# EAGLE design Main (EAGLE 8.6.3)
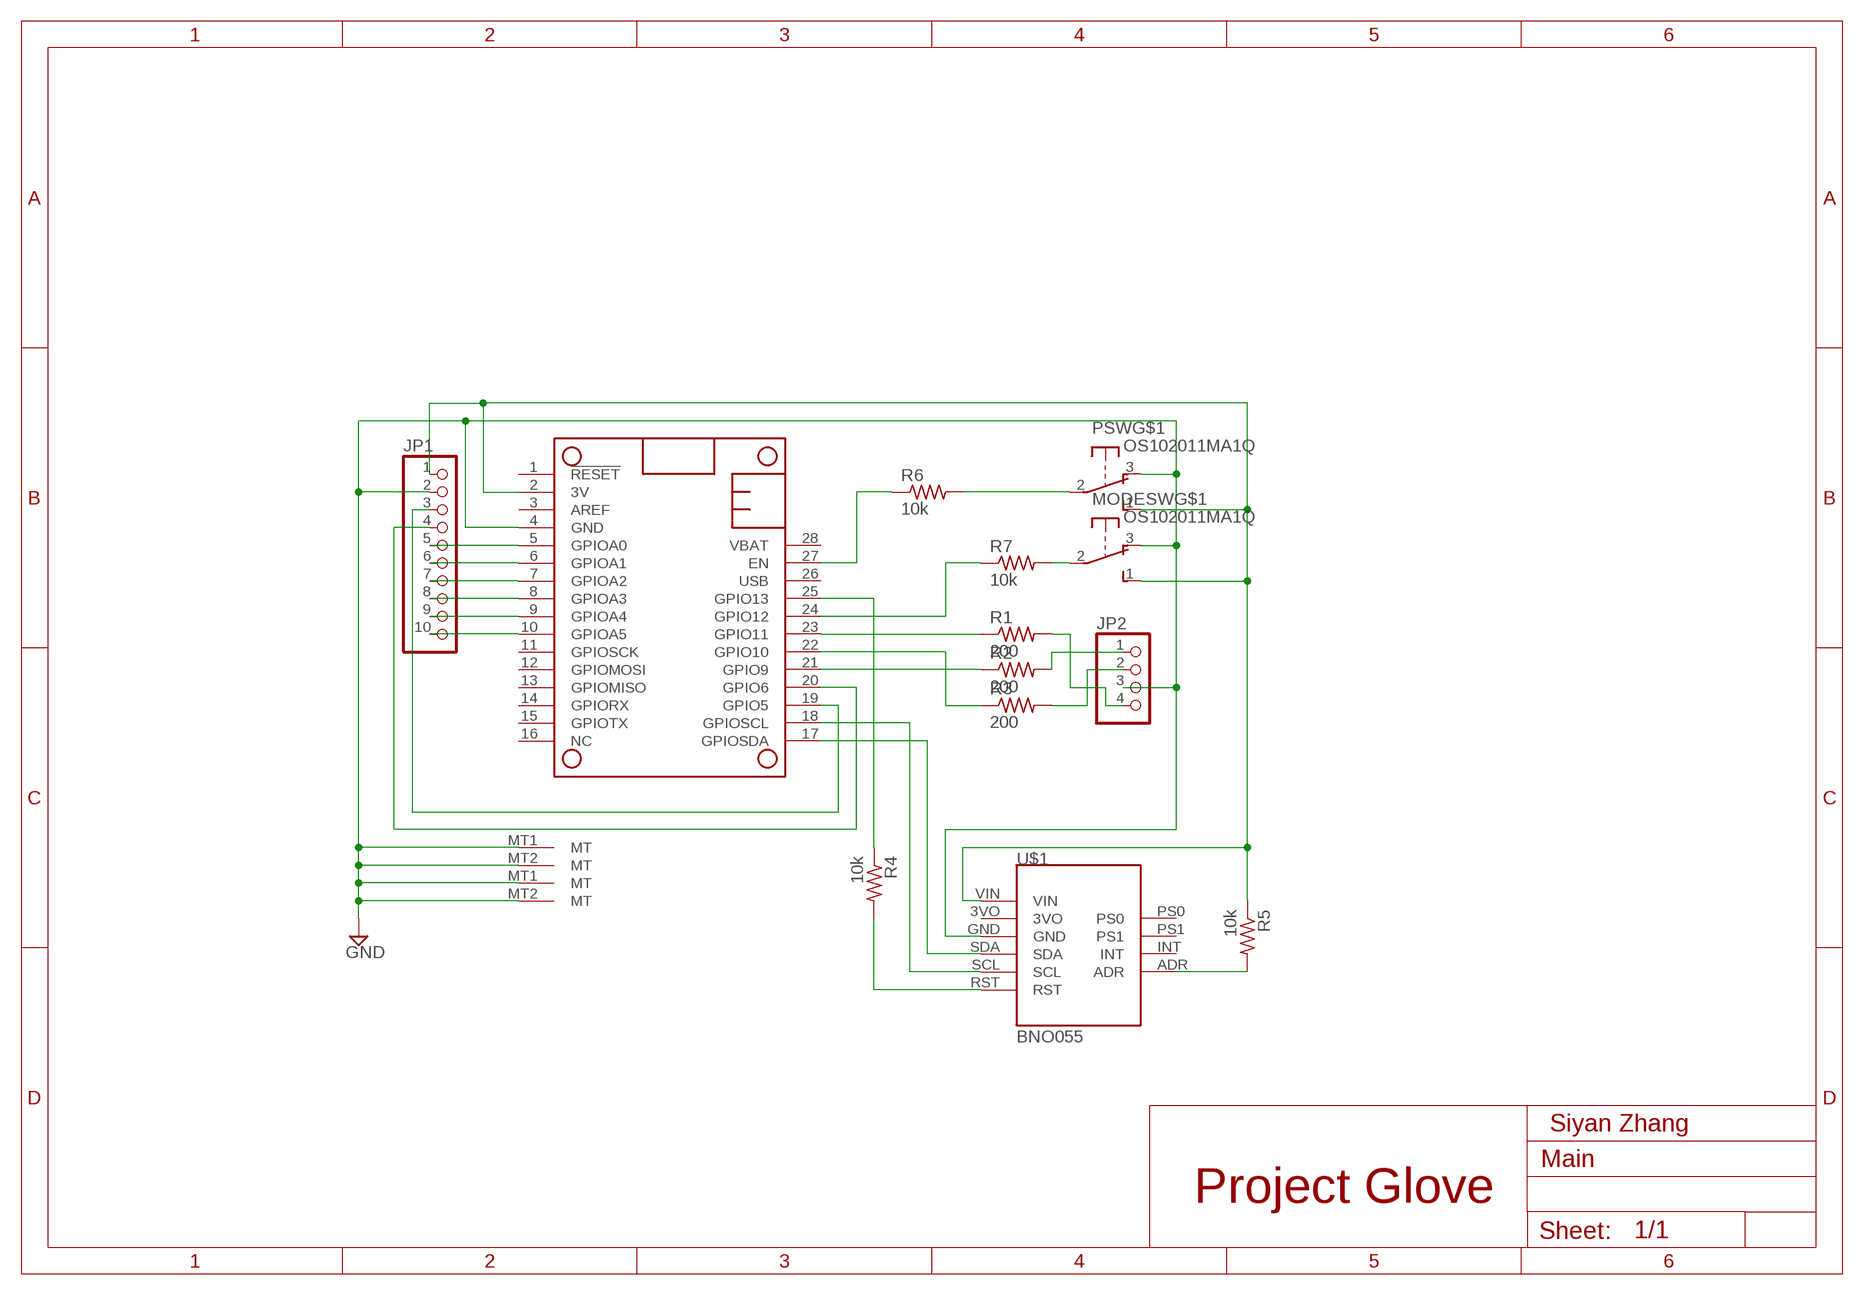
[diagram p0: schematic, sheet 1]

## Parts
JP1  PINHD-1X10  [1X10]
JP2  PINHD-1X4  [1X04]
MODESW  OS102011MA1Q  [OS102011MA1Q]
MS1  FEATHERWING  [FEATHERWING]
PSW  OS102011MA1Q  [OS102011MA1Q]
R1  200  R-US_0207/7  [0207/7]
R2  200  R-US_0207/7  [0207/7]
R3  200  R-US_0207/7  [0207/7]
R4  10k  R-US_0207/7  [0207/7]
R5  10k  R-US_0207/15  [0207/15]
R6  10k  R-US_0207/7  [0207/7]
R7  10k  R-US_0207/7  [0207/7]
U$1  BNO055  [BNO055]

## Nets
3V: JP1.1 MODESW.1(S) MS1.2(3V) PSW.1(S) R5.1 U$1.VIN
GND: JP1.2 JP2.3 MODESW.3(O) MODESW.MT1(MT) MODESW.MT2(MT) MS1.4(GND) PSW.3(O) PSW.MT1(MT) PSW.MT2(MT) U$1.GND
N$1: MODESW.2(P) R7.2
N$2: MS1.24(GPIO12) R7.1
N$3: MS1.22(GPIO10) R3.1
N$4: MS1.21(GPIO9) R2.1
N$5: MS1.23(GPIO11) R1.1
N$6: JP2.4 R1.2
N$7: JP2.1 R2.2
N$8: JP2.2 R3.2
N$9: JP1.10 MS1.10(GPIOA5)
N$10: JP1.9 MS1.9(GPIOA4)
N$11: JP1.8 MS1.8(GPIOA3)
N$12: JP1.7 MS1.7(GPIOA2)
N$13: JP1.6 MS1.6(GPIOA1)
N$14: MS1.17(GPIOSDA) U$1.SDA
N$15: MS1.18(GPIOSCL) U$1.SCL
N$16: R4.2 U$1.RST
N$17: R5.2 U$1.ADR
N$18: MS1.25(GPIO13) R4.1
N$19: JP1.5 MS1.5(GPIOA0)
N$20: PSW.2(P) R6.2
N$21: MS1.27(EN) R6.1
N$22: JP1.3 MS1.19(GPIO5)
N$23: JP1.4 MS1.20(GPIO6)
Unconnected: MS1.1(!RESET) MS1.3(AREF) MS1.11(GPIOSCK) MS1.12(GPIOMOSI) MS1.13(GPIOMISO) MS1.14(GPIORX) MS1.15(GPIOTX) MS1.16(NC) MS1.26(USB) MS1.28(VBAT) U$1.3VO U$1.INT U$1.PS0 U$1.PS1

## Notes on the sheet
- Siyan Zhang
- Project Glove
- Sheet:

## Library data of the parts
JP1 = pinhead:PINHD-1X10: PIN HEADER
JP2 = pinhead:PINHD-1X4: PIN HEADER
MODESW PSW = adafruit:OS102011MA1Q: OS10201MA1Q through-hole right angle switch http://www.ladyada.net/library/eagle
MS1 = adafruit:FEATHERWING
R1-R7 = resistor:R-US_: RESISTOR, American symbol
U$1 = Adafruit_BNO055:BNO055

## Board
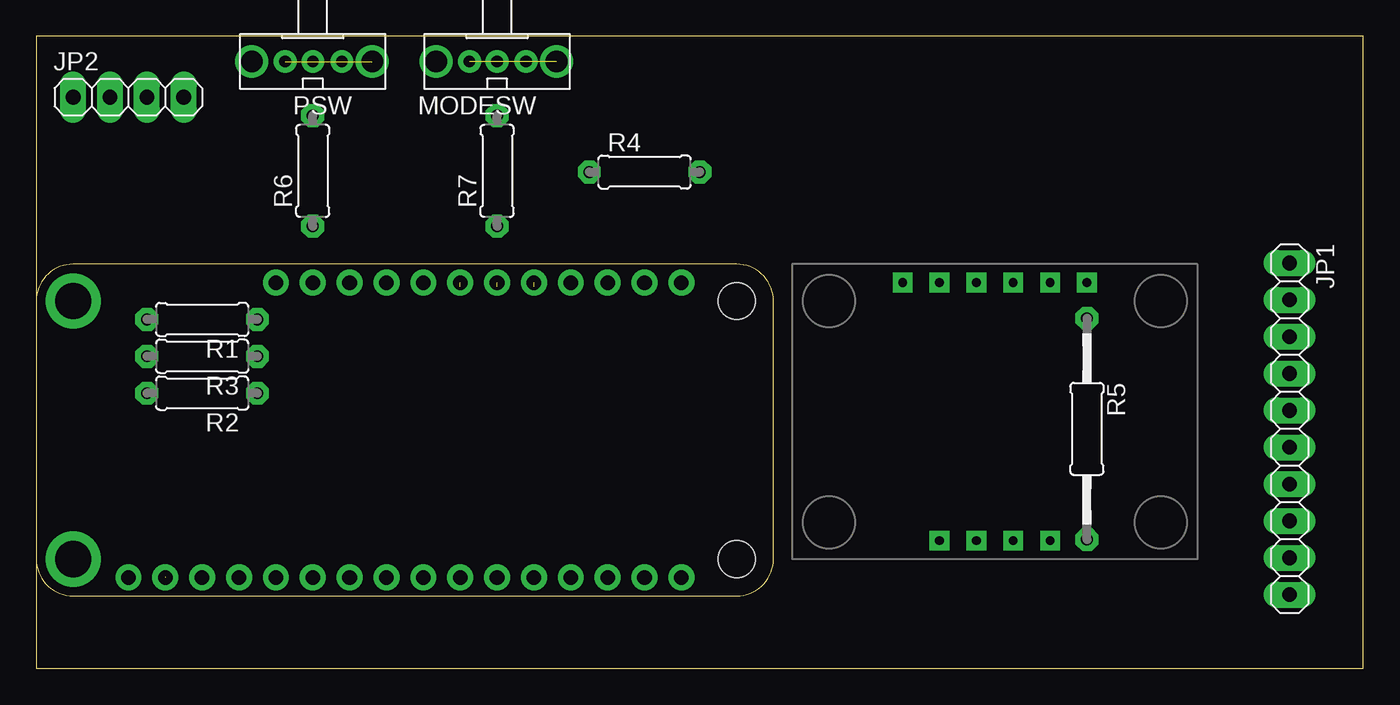
[diagram p1: board, top side]
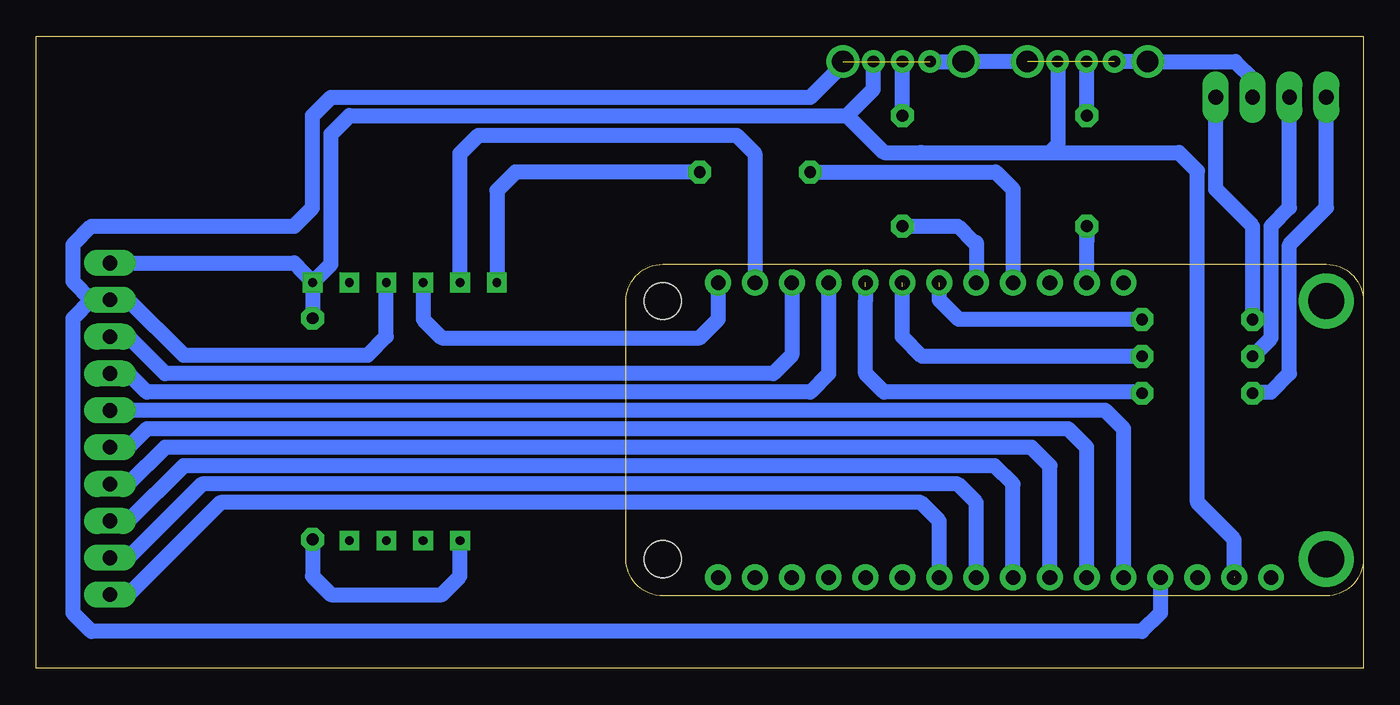
[diagram p2: board, bottom side, seen from below]

Size 91.43 x 43.57 mm. Coordinates in mm from the lower left corner, seen from the top.
Outline: 0,0 91.43,0 91.43,43.57 0,43.57 0,0
Copper layers (1*16): Top 0.035mm / dielectric 1.5mm / Bottom 0.035mm
Design rules "default *": minimum track width 6mil, minimum drill 0.35mm, track to track 6mil, track to pad 6mil, pad to pad 6mil, via to via 6mil, smd to smd 6mil, copper to edge 40mil, drill to drill 6mil, minimum pad ring 15mil, minimum via ring 8mil, stop-mask expansion 4mil, vias tented up to drill 0mil, thermal gap 10mil

### Footprints (pad centres in the part's own frame; a part is rotated, then mirrored left to right if it is on the bottom)
1X10 = drill 1.016 long: 1 -11.43,0; 2 -8.89,0; 3 -6.35,0; 4 -3.81,0; 5 -1.27,0; 6 1.27,0; 7 3.81,0; 8 6.35,0; 9 8.89,0; 10 11.43,0
1X04 = drill 1.016 long: 1 -3.81,0; 2 -1.27,0; 3 1.27,0; 4 3.81,0
OS102011MA1Q = drill 0.8 pad 1.422: 1 -2,0; 2 0,0; 3 1.9,0 | drill 1.5 pad 2.184: MT1 -4.1,0; MT2 4.2,0
FEATHERWING = drill 1 pad 1.778: 1 6.35,1.27; 2 8.89,1.27; 3 11.43,1.27; 4 13.97,1.27; 5 16.51,1.27; 6 19.05,1.27; 7 21.59,1.27; 8 24.13,1.27; 9 26.67,1.27; 10 29.21,1.27; 11 31.75,1.27; 12 34.29,1.27; 13 36.83,1.27; 14 39.37,1.27; 15 41.91,1.27; 16 44.45,1.27; 17 44.45,21.59; 18 41.91,21.59; 19 39.37,21.59; 20 36.83,21.59; 21 34.29,21.59; 22 31.75,21.59; 23 29.21,21.59; 24 26.67,21.59; 25 24.13,21.59; 26 21.59,21.59; 27 19.05,21.59; 28 16.51,21.59 | drill 2.5 pad 3.81: P$1 2.54,20.32; P$2 2.54,2.54 | hole 2.54: 48.26,20.32; 48.26,2.54
0207/7 = drill 0.813 octagon: 1 -3.81,0; 2 3.81,0
0207/15 = drill 0.813 octagon: 1 -7.62,0; 2 7.62,0
BNO055 = drill 0.6 square: 3VO -10.16,3.81; ADR 7.62,-3.81; GND -10.16,1.27; INT 7.62,-1.27; PS0 7.62,3.81; PS1 7.62,1.27; RST -10.16,-6.35; SCL -10.16,-3.81; SDA -10.16,-1.27; VIN -10.16,6.35

### Placement (x,y rotation side)
JP1  86.36,16.51 270 top
JP2  6.35,39.37 0 top
MODESW  31.75,41.83 180 top
MS1  0,5 0 top
PSW  19.05,41.83 180 top
R1  11.43,24.05 180 top
R2  11.43,18.97 180 top
R3  11.43,21.51 180 top
R4  41.91,34.21 0 top
R5  72.39,16.51 270 top
R6  19.05,34.29 90 top
R7  31.75,34.29 90 top
U$1  66.04,16.43 270 top
U$2  [A4L-LOC]  -77.47,-64.77 0 top  (outside the outline)

### Tracks (layer width: path | path; a pad name or v marks a point on that pad's centre or on a via)
3V  (1 unrouted)
  Bottom 1.016: 21.59,35.56 12.7,35.56 11.43,34.29 11.43,11.43 8.89,8.89 8.89,6.32 | JP1.1 73.66,27.94 U$1.VIN | U$1.VIN 71.12,27.86 71.12,36.83 69.85,38.1 35.56,38.1 | 35.56,38.1 33.02,35.56 30.48,35.56 30.48,35.57 30.47,35.56 21.59,35.56 | PSW.1 21.05,36.1 21.59,35.56 | U$1.VIN R5.1 | 35.56,38.1 33.75,39.91 MODESW.1
GND  (2 unrouted)
  Bottom 1.016: PSW.MT1 MODESW.MT2 MODESW.3 | PSW.3 PSW.MT2 8.81,41.83 7.62,40.64 JP2.3 | U$1.GND 67.31,22.86 68.58,21.59 81.28,21.59 85.09,25.4 JP1.2 87.63,25.4 | 87.63,25.4 88.9,26.67 88.9,29.21 87.63,30.48 73.66,30.48 72.39,31.75 72.39,38.1 71.12,39.37 38.1,39.37 35.85,41.62 MODESW.MT1 | MS1.4 13.97,3.81 15.24,2.54 87.63,2.54 88.9,3.81 88.9,24.13 87.63,25.4
N$1
  Bottom 1.016: R7.2 MODESW.2
N$2
  Bottom 1.016: R7.1 27.94,30.48 26.84,29.38 26.67,29.38 MS1.24
N$3  (1 unrouted)
  Bottom 1.016: R3.1 30.4,21.51 31.75,22.86 31.75,26.34
N$4  (1 unrouted)
  Bottom 1.016: R2.1 15.32,19.05 33.02,19.05 34.29,20.32 34.29,25.4 34.29,26.34
N$5  (1 unrouted)
  Bottom 1.016: R1.1 27.86,24.05 29.21,25.4 29.21,26.34
N$6
  Bottom 1.016: R1.2 7.62,30.48 10.16,33.02 JP2.4
N$7
  Bottom 1.016: R2.2 7.54,19.05 6.35,19.05 5.08,20.32 5.08,29.21 2.54,31.75 JP2.1
N$8
  Bottom 1.016: R3.2 6.35,22.78 6.35,30.48 5.08,31.75 JP2.2
N$9
  Bottom 0.61: 85.09,5.08 JP1.10
  Bottom 1.016: MS1.10 29.21,10.16 30.48,11.43 78.74,11.43 85.09,5.08
N$10
  Bottom 0.61: 85.09,7.62 JP1.9
  Bottom 1.016: MS1.9 26.67,11.43 27.94,12.7 80.01,12.7 85.09,7.62
N$11
  Bottom 0.61: 85.09,10.16 JP1.8
  Bottom 1.016: MS1.8 24.13,12.7 25.4,13.97 81.28,13.97 85.09,10.16
N$12
  Bottom 0.61: 85.09,12.7 JP1.7
  Bottom 1.016: MS1.7 21.59,13.97 22.86,15.24 82.55,15.24 85.09,12.7
N$13
  Bottom 0.61: 85.09,15.24 JP1.6
  Bottom 1.016: MS1.6 19.05,15.24 20.32,16.51 83.82,16.51 85.09,15.24
N$14
  Bottom 1.016: U$1.SDA 64.77,24.05 63.5,22.78 45.72,22.78 44.45,24.05 MS1.17
N$15
  Bottom 1.016: U$1.SCL 62.23,35.48 60.96,36.75 43.18,36.75 41.91,35.48 MS1.18
N$16
  Bottom 1.016: R4.2 58.42,34.21 59.69,32.94 U$1.RST
N$17
  Bottom 1.016: R5.2 72.39,6.35 71.12,5.08 63.5,5.08 62.23,6.35 U$1.ADR
N$18
  Bottom 1.016: R4.1 25.32,34.21 24.13,33.02 MS1.25
N$19
  Bottom 1.016: MS1.5 16.51,16.51 17.78,17.78 JP1.5
N$20
  Bottom 1.016: R6.2 PSW.2 19.05,41.91
N$21
  Bottom 1.016: 19.05,29.38 R6.1 MS1.27
N$22
  Bottom 1.016: MS1.19 39.37,21.59 40.64,20.32 82.55,20.32 85.09,22.86 JP1.3
N$23
  Bottom 1.016: MS1.20 36.83,20.32 38.1,19.05 83.82,19.05 85.09,20.32 JP1.4

### Text on the board
tNames: Siyan Zhang
tValues: Project Glove